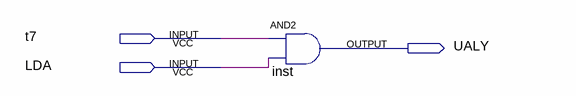
[diagram p0: schematic sheet]
// Quartus schematic UALY.bdf as structural Verilog: 1 symbols, 3 pins
module UALY (
  input  t7,
  input  LDA,
  output UALY
);

  and inst (UALY, t7, LDA);
endmodule
